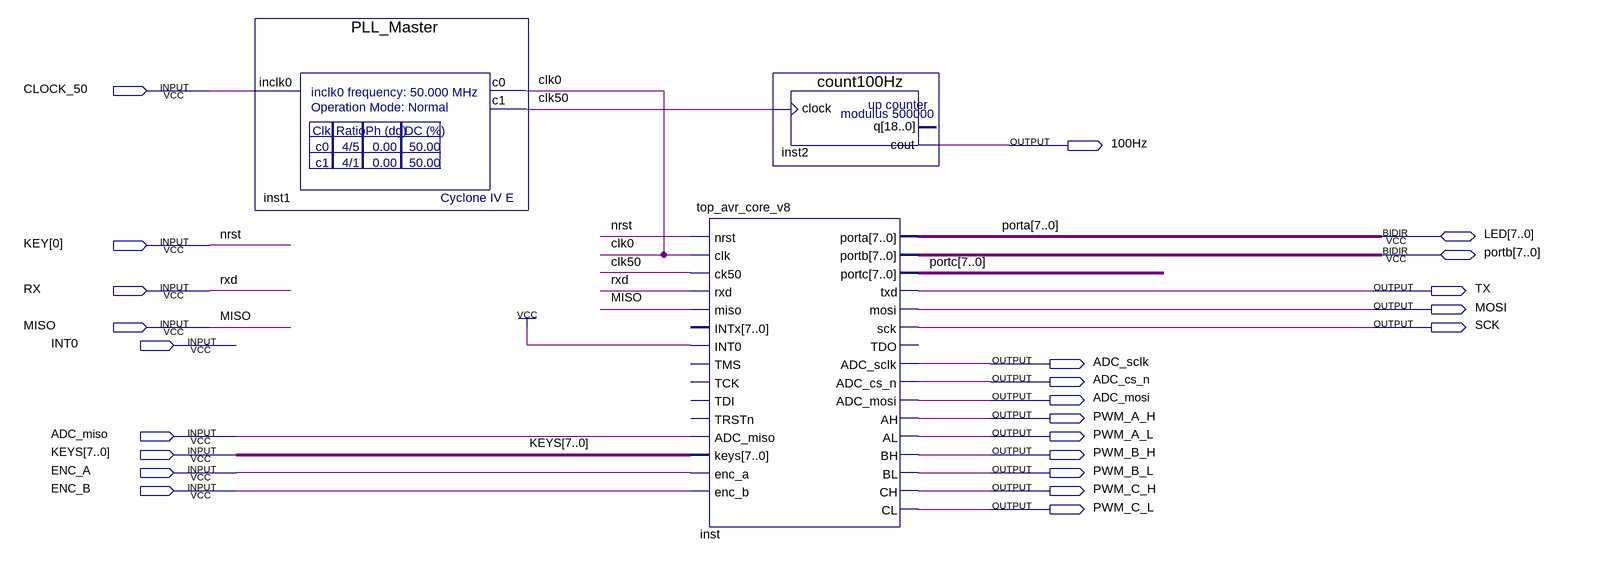
[diagram p0: schematic sheet]
// Quartus schematic Optic_Gen_V5.bdf as structural Verilog: 3 symbols, 24 pins
module Optic_Gen_V5 (
  input  CLOCK_50,
  input  [0:0] KEY,
  input  RX,
  input  MISO,
  input  INT0,
  input  ADC_miso,
  input  [7:0] KEYS,
  input  ENC_A,
  input  ENC_B,
  inout  [7:0] LED,
  inout  [7:0] portb,
  output \100Hz ,
  output TX,
  output MOSI,
  output SCK,
  output ADC_sclk,
  output ADC_cs_n,
  output ADC_mosi,
  output PWM_A_H,
  output PWM_A_L,
  output PWM_B_H,
  output PWM_B_L,
  output PWM_C_H,
  output PWM_C_L
);

  wire clk0, clk50;
  wire [7:0] portc;

  PLL_Master inst1 (.inclk0(CLOCK_50), .c0(clk0), .c1(clk50));
  top_avr_core_v8 inst (
    .nrst(KEY[0]), .clk(clk0), .ck50(clk50), .rxd(RX), .miso(MISO), .INT0(1'b1), .ADC_miso(ADC_miso),
    .keys(KEYS), .enc_a(ENC_A), .enc_b(ENC_B), .txd(TX), .mosi(MOSI), .sck(SCK), .ADC_sclk(ADC_sclk),
    .ADC_cs_n(ADC_cs_n), .ADC_mosi(ADC_mosi), .AH(PWM_A_H), .AL(PWM_A_L), .BH(PWM_B_H), .BL(PWM_B_L),
    .CH(PWM_C_H), .CL(PWM_C_L), .porta(LED), .portb(portb), .portc(portc));  // open: INTx, TMS, TCK, TDI, TRSTn, TDO
  count100Hz inst2 (.clock(clk50), .cout(\100Hz ));  // open: q

  // Other names for the same wires on the sheet: nrst = KEY[0]; porta[7:0] = LED; rxd = RX
endmodule
